# Altium schematic sheet 04_ADC.SchDoc: ADC
size A4; SheetNumber: 5; SheetTotal: 7; Project_Name: Monitoring_Control_Circuit; Designer: Hao Thai; Version: 1.0
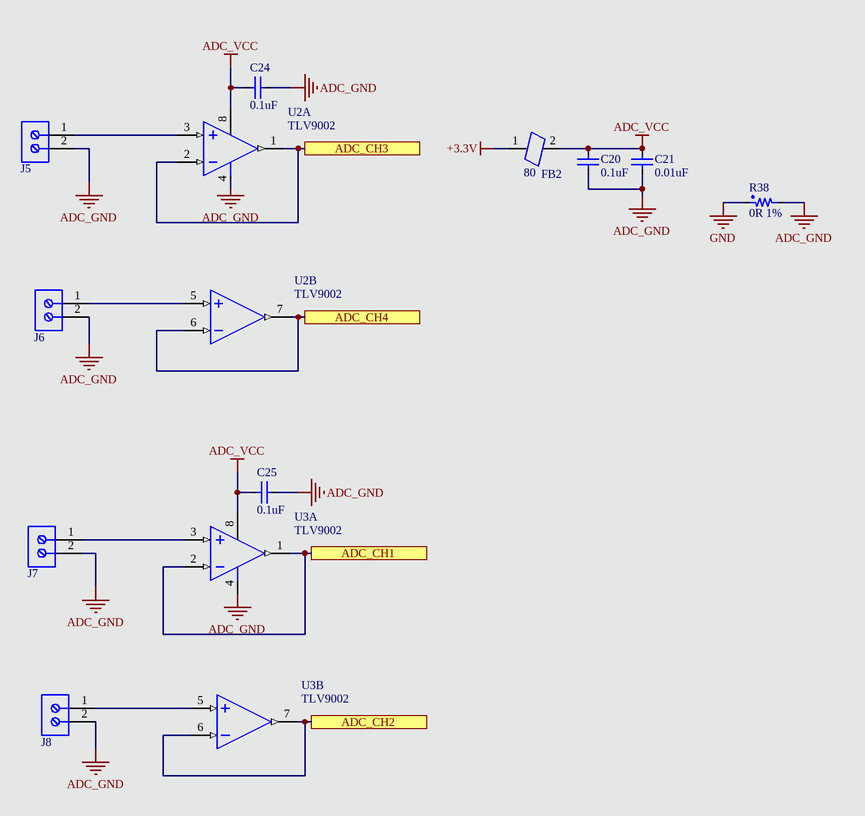
[diagram p0: 04_ADC.SchDoc]

## Parts
C20  0.1uF  [C0603 (1608 metric)]
C21  0.01uF  [C0603 (1608 metric)]
C24  0.1uF  [C0603 (1608 metric)]
C25  0.1uF  [C0603 (1608 metric)]
FB2  80  [FB0805 (2012 METRIC)]
J5  691103110002  [691103110002]  (value not drawn)
J6  691103110002  [691103110002]  (value not drawn)
J7  691103110002  [691103110002]  (value not drawn)
J8  691103110002  [691103110002]  (value not drawn)
R38  0R 1%  [R0603 (1608 Metric)]
U2  TLV9002  [VSSOP-8_DGK]  (parts A,B of 2)
U3  TLV9002  [VSSOP-8_DGK]  (parts A,B of 2)

## Ports
ADC_CH1, ADC_CH2, ADC_CH3, ADC_CH4

## Nets
+3.3V: FB2.1
ADC_GND: C20.1 C21.1 C24.2 C25.2 J5.2 J6.2 J7.2 J8.2 R38.2 U2.4(-V) U3.4(-V)
ADC_VCC: C20.2 C21.2 C24.1 C25.1 FB2.2 U2.8(+V) U3.8(+V)
GND: R38.1
ADC_CH1: U3.1(OUT) U3.2(IN-) ; port ADC_CH1
ADC_CH2: U3.6(IN-) U3.7(OUT) ; port ADC_CH2
ADC_CH3: U2.1(OUT) U2.2(IN-) ; port ADC_CH3
ADC_CH4: U2.6(IN-) U2.7(OUT) ; port ADC_CH4
NetJ5_1: J5.1 U2.3(IN+)
NetJ6_1: J6.1 U2.5(IN+)
NetJ7_1: J7.1 U3.3(IN+)
NetJ8_1: J8.1 U3.5(IN+)

## Notes on the sheet
- Document Title:
- BK Maker Club
- Size:
- Project Name:
- A4
- Designer:
- Reviewer:
- Revision:
- Sheet
- of
- Nguyen Xien Street
- Long Thanh My Ward, Thu Duc District
- Ho Chi Minh City
- Date:
- File:

## Library data of the parts
C20 C24 C25 = CC0603KRX7R9BB104: Multilayer Ceramic Capacitors MLCC - SMD/SMT 0.1uF 50V X7R +/-10% 0603; Mfr: Yageo; Tolerance: 10%; Mfr Part Number: CC0603KRX7R9BB104; Supplier Part Number 1: 603-CC603KRX7R9BB104; Supplier 1: Mouser; Value: 0.1uF; Dielectric: X7R; Case: 0603 (1608 metric); Voltage: 50V
C21 = CC0603KRX7R9BB103: Multilayer Ceramic Capacitors MLCC - SMD/SMT 0.01uF 50V X7R +/-10% 0603; Mfr: Yageo; Tolerance: 10%; Mfr Part Number: CC0603KRX7R9BB103; Supplier Part Number 1: 603-CC603KRX7R9BB103; Supplier 1: Mouser; Value: 0.01uF; Dielectric: X7R; Case: 0603 (1608 metric); Voltage: 50V
FB2 = FBMH2012HM800-T: Ferrite Beads HI CUR CHIP BD 0805 80OHMS 25%; Mfr: Taiyo Yuden; Maximum DC Resistance: 25 mOhm; Maximum DC Current: 2.7A; Impedance: 80; Supplier Part Number 1: 963-FBMH2012HM800-T; Mfr Part Number: FBMH2012HM800-T; Supplier 1: Mouser; Tolerance: 25%; Package: 0805 (2012 metric)
J5-J8 = 691103110002: WR-TBL Series 1031 Horizontal Entry Modular, THT, pitch 3.5mm, 2p; Mfr: Wurth Elektronik; Modularity: Yes; Rated Current: 10A; Working Voltage: 125V; ComponentLink1Description: Website Link; ComponentLink1URL: https://www.we-online.com/redexpert/article/691103110002?ad; ComponentLink2Description: Datasheet Link; ComponentLink2URL: https://www.we-online.com/redexpert/spec/691103110002?ad; Mfr Part Number: 691103110002; Category: Terminal Blocks; Match Code: WR-TBL; Mount: Through Hole; Operating Temperature Max: 105°C; Operating Temperature Min: -40°C; Packaging: Box; Application: Pressure Clamp; Number of Pins: 2; Number of Rows: 1; Orientation: Horizontal; Pitch: 3.5mm
R38 = RC0603FR-070RL: Thick Film Resistors - SMD 0 OHM 1% Case 0603; Mfr: Yageo; Value: 0R; Supplier 1: Mouser; Supplier Part Number 1: 603-RC0603FR-070RL; Mfr Part Number: RC0603FR-070RL; Case: 0603 (1608 metric); Tolerance: 1%
U2 U3 = TLV9002IDGKR: General Purpose Amplifier 2 Circuit Rail-to-Rail 8-VSSOP; Mfr: Texas Instruments; Value: TLV9002; Mfr Part Number: TLV9002IDGKR; Supplier 1: Mouser; Supplier Part Number 1: 595-TLV9002IDGKR; Package: 8-TSSOP